# Altium project 3D_Scanner.PrjPcb
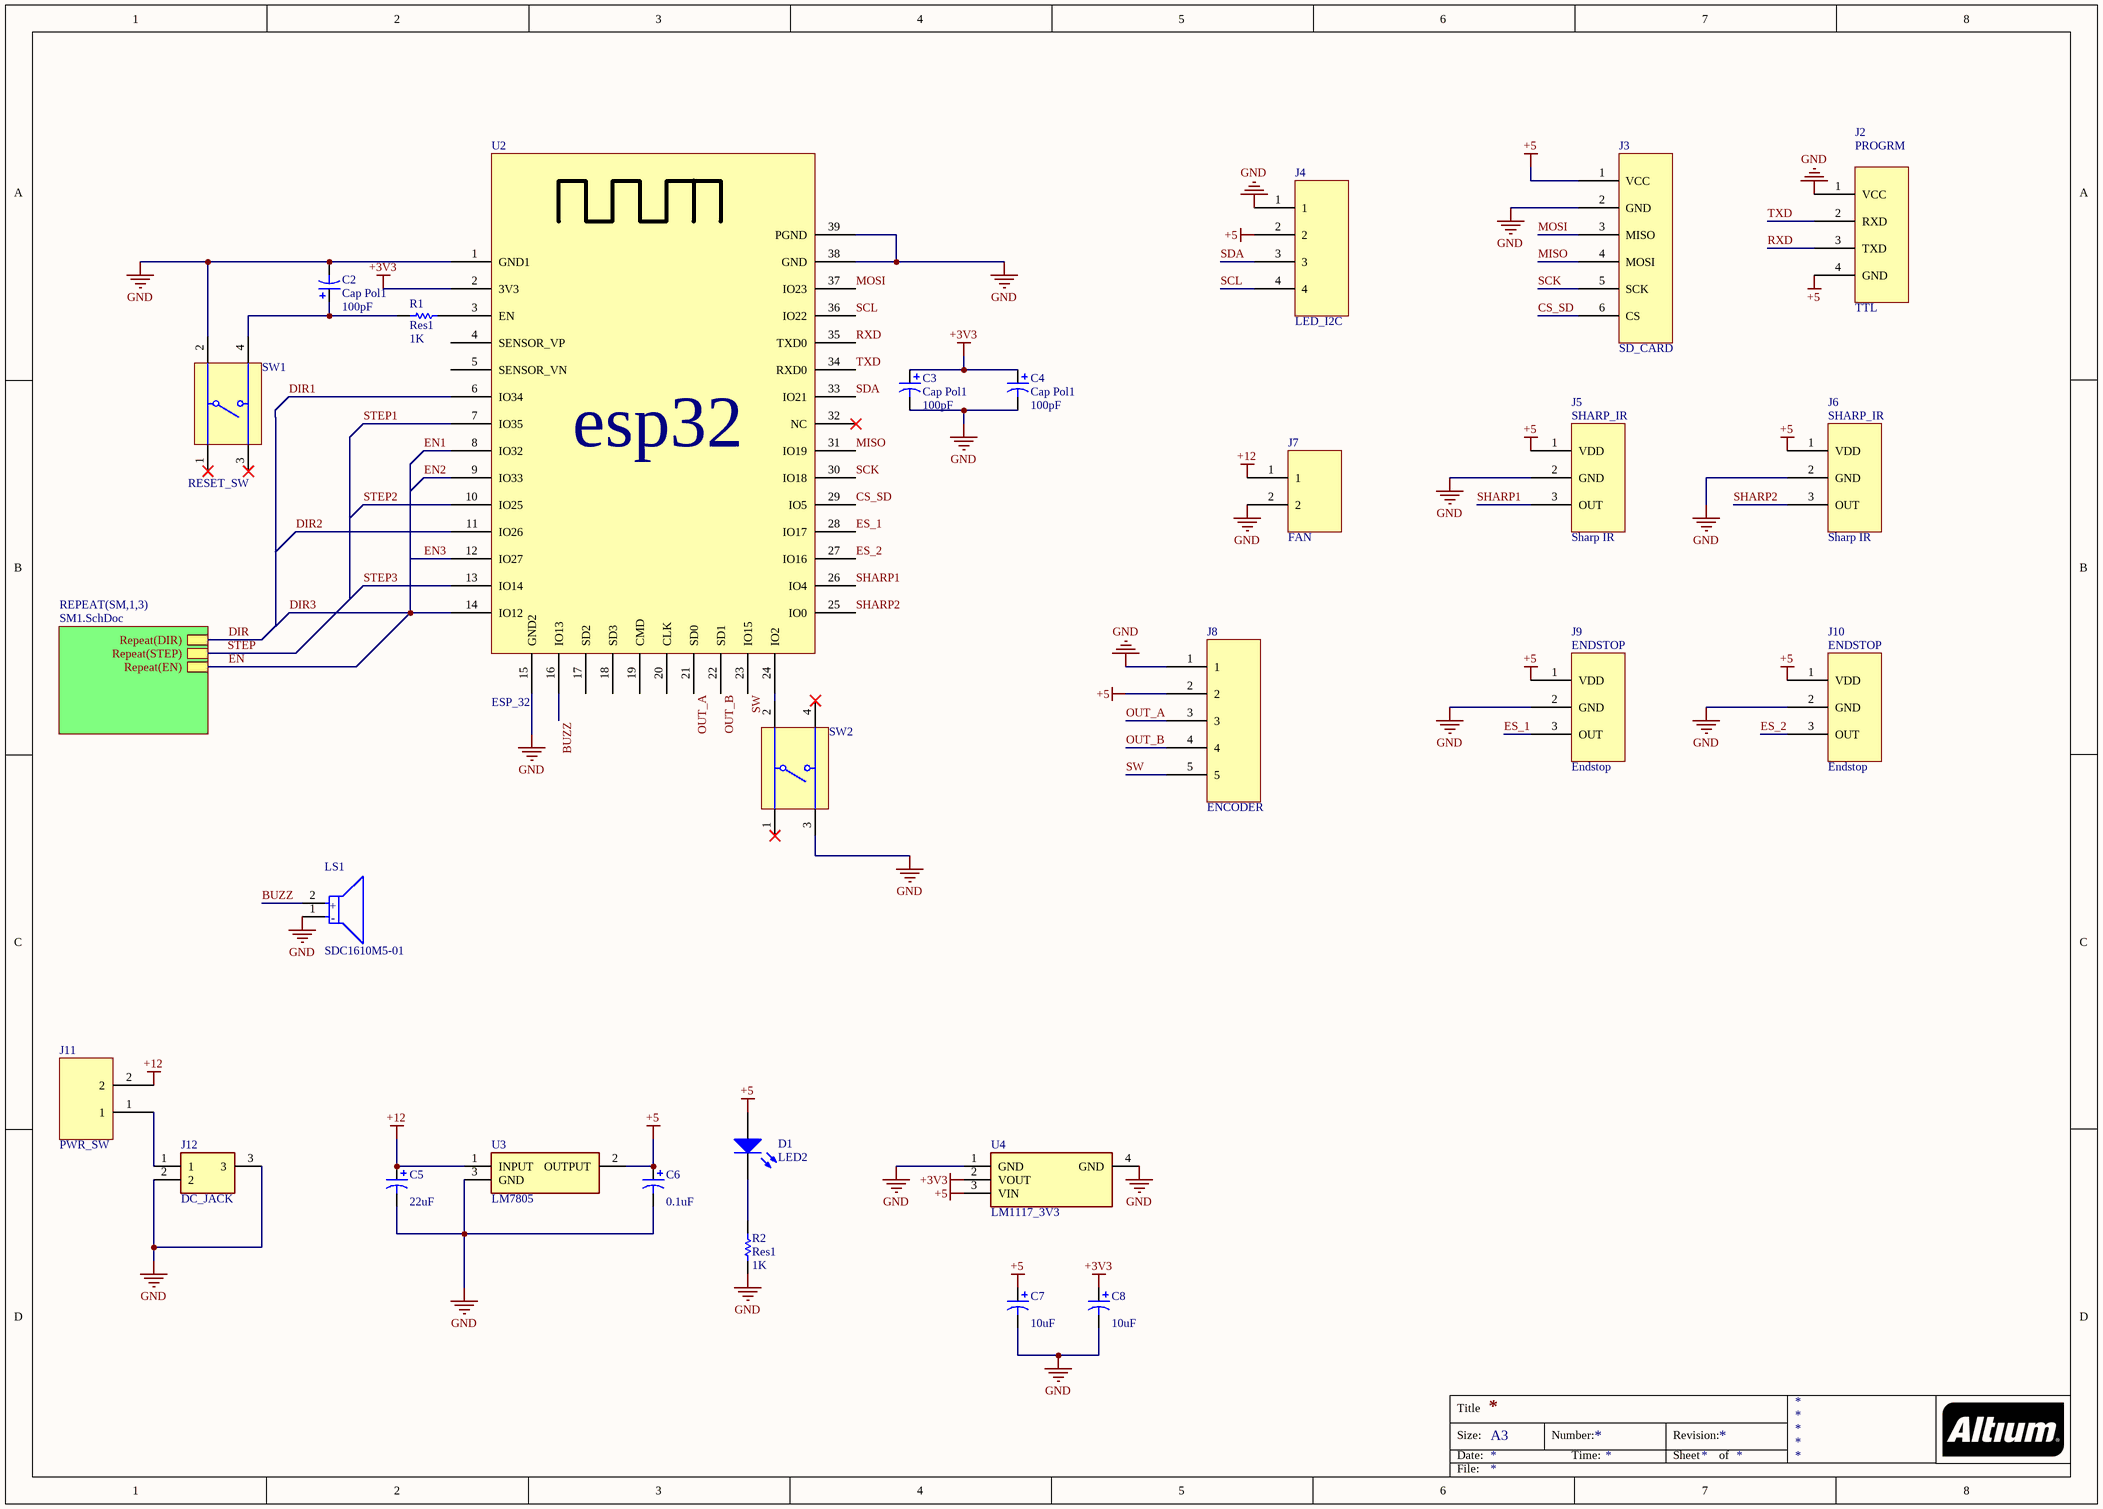
[diagram p0: Sheet.SchDoc]
2 sheets, 36 parts. Net scope: hierarchical (ports join the sheet entries above them; power ports are global).
Board file: PCB1.PcbDoc
Sheets:
  Sheet.SchDoc
    SM1 = SM1.SchDoc
    SM2 = SM1.SchDoc
    SM3 = SM1.SchDoc

## Sheet Sheet.SchDoc
size A3

### Parts
C2  Cap Pol1  value 100pF  [6-0805_N]
C3  Cap Pol1  value 100pF  [6-0805_N]
C4  Cap Pol1  value 100pF  [6-0805_N]
C5  value 22uF  [6-0805_N]  (hidden comment: Cap Pol1)
C6  value 0.1uF  [6-0805_N]  (hidden comment: Cap Pol1)
C7  value 10uF  [6-0805_N]  (hidden comment: Cap Pol1)
C8  value 10uF  [6-0805_N]  (hidden comment: Cap Pol1)
D1  LED2  [3.2X1.6X1.1]
J2  TTL  [TTL]
J3  SD_CARD  [SD_CARD]
J4  LED_I2C  [JST_4P]
J5  Sharp IR  [SHARP_IR]
J6  Sharp IR  [SHARP_IR]
J7  FAN  [JST_2P]
J8  ENCODER  [JST_5P]
J9  Endstop  [ENDSTOP]
J10  Endstop  [ENDSTOP]
J11  PWR_SW  [JST_2P]
J12  DC_JACK  [DC_JACK]
LS1  SDC1610M5-01  [FP-SDC1610M5-01-MFG]
R1  Res1  value 1K  [6-0805_N]
R2  Res1  value 1K  [6-0805_N]
SW1  RESET_SW  [TECO-1825910-6_V]
SW2  1825910-6  [TECO-1825910-6_V]  (value not drawn)
U2  ESP_32  [ESP_SoC_Module]
U3  LM7805  [LM7805]
U4  LM1117_3V3  [LM1117_3V3]

### Sub-sheets
REPEAT(SM,1,3) = SM1.SchDoc: Repeat(DIR), Repeat(STEP), Repeat(EN)

### Nets
+3V3: C3.1 C4.1 C8.1 U2.2(3V3) U4.2(VOUT)
+5: C6.1 C7.1 D1.1(A) J2.4(GND) J3.1(VCC) J4.2 J5.1(VDD) J6.1(VDD) J8.2 J9.1(VDD) J10.1(VDD) U3.2(OUTPUT) U4.3(VIN)
+12: C5.1 J7.1 J11.2 U3.1(INPUT)
GND: C2.2 C3.2 C4.2 C5.2 C6.2 C7.2 C8.2 J2.1(VCC) J3.2(GND) J4.1 J5.2(GND) J6.2(GND) J7.2 J8.1 J9.2(GND) J10.2(GND) J12.2 J12.3 LS1.1(C) R2.1 SW1.2 SW2.3 U2.1(GND1) U2.15(GND2) U2.38(GND) U2.39(PGND) U3.3(GND) U4.1(GND) U4.4(GND)
BUZZ: LS1.2(A) U2.16(IO13)
CS_SD: J3.6(CS) U2.29(IO5)
DIR: sheet REPEAT(SM,1,3)/Repeat(DIR)
DIR1: U2.6(IO34)
DIR2: U2.11(IO26)
DIR3: U2.14(IO12)
EN: sheet REPEAT(SM,1,3)/Repeat(EN)
EN1: U2.8(IO32)
EN2: U2.9(IO33)
EN3: U2.12(IO27)
ES_1: J9.3(OUT) U2.28(IO17)
ES_2: J10.3(OUT) U2.27(IO16)
MISO: J3.4(MOSI) U2.31(IO19)
MOSI: J3.3(MISO) U2.37(IO23)
OUT_A: J8.3 U2.21(SD0)
OUT_B: J8.4 U2.22(SD1)
RXD: J2.3(TXD) U2.35(TXD0)
SCK: J3.5(SCK) U2.30(IO18)
SCL: J4.4 U2.36(IO22)
SDA: J4.3 U2.33(IO21)
SHARP1: J5.3(OUT) U2.26(IO4)
SHARP2: J6.3(OUT) U2.25(IO0)
STEP: sheet REPEAT(SM,1,3)/Repeat(STEP)
STEP1: U2.7(IO35)
STEP2: U2.10(IO25)
STEP3: U2.13(IO14)
SW: J8.5 U2.23(IO15)
TXD: J2.2(RXD) U2.34(RXD0)
NetC2_1: C2.1 R1.1 SW1.4
NetD1_2: D1.2(K) R2.2
NetJ11_1: J11.1 J12.1
NetR1_2: R1.2 U2.3(EN)
NetSW2_2: SW2.2 U2.24(IO2)

Not connected (* = marked no-connect by the designer): SW1 1* 3*; SW2 1* 4*; U2 4(SENSOR_VP) 5(SENSOR_VN) 17(SD2) 18(SD3) 19(CMD) 20(CLK) 32(NC)*

### Notes on the sheet
- Title
- Size:
- Date:
- A3
- Number:
- Time:
- Revision:
- Sheet
- of
- File:
- (in symbol CMP-08413-000008-1) +; -
- (in symbol ESP_SoC_Module) esp32
- (in symbol TTL) PROGRM

### Library data of the parts
C2-C8 = Cap Pol1: Polarized Capacitor (Radial); Published: 8-Jun-2000; LatestRevisionDate: 17-Jul-2002; LatestRevisionNote: Re-released for DXP Platform.; PackageReference: RB7.6-15; Publisher: Altium Limited; PackageDescription: Polarized Capacitor (Radial); 2 Leads
D1 = LED2: Typical RED, GREEN, YELLOW, AMBER GaAs LED; Published: 8-Jun-2000; LatestRevisionDate: 17-Jul-2002; LatestRevisionNote: Re-released for DXP Platform.; PackageVersion: Feb-2002; PackageReference: 3.2X1.6X1.1; Publisher: Altium Limited; PackageDescription: SM LED; 2 Flat Leads
J4 = JST_4P
J5 J6 = SHARP_IR
J7 J11 = JST_2P
J8 = JST_5P
LS1 = CMP-08413-000008-1: AUDIO MAGNETIC INDICATOR 4-8V TH; Nominal Supply Voltage (DC): 5V; Input Type: DC; Max Supply Current: 30mA; Number of Terminals/Pins: 2; Frequency: 2.4kHz; Lead Free: Lead Free; Operating Supply Current: 30mA; Sensing Method: Magnetic; Termination: PC Pins; Number of Pins: 2; Mount: Through Hole; Min Operating Temperature: -10°C; Diameter: 16mm; Series: SDC; Max Operating Temperature: 70°C; Packaging: Tray; Voltage Rating: 5V; Height: 10mm
R1 R2 = Res1: Resistor; Published: 8-Jun-2000; LatestRevisionDate: 17-Jul-2002; LatestRevisionNote: Re-released for DXP Platform.; PackageReference: AXIAL-0.3; Publisher: Altium Limited; PackageDescription: Axial Device, Thru-Hole; 2 Leads; 0.3 in Pin Spacing
SW1 = CMP-1684-00021-1: Tact Switch, SPST-NO, 0.05 A, -35 to 85 degC, 4-Pin THD, RoHS, Bulk; Part No: 1825910-6; Manufacturer: TE Connectivity; Maximum Contact Resistance: 100mOhm; Mechanical Life: 100000Cycles; Bushing Type: Unthreaded; Switch Configuration: OFF(ON); Maximum DC Voltage Rating: 24V; Contact Rating @ Voltage: 0.05A@24VDC; Actuator Color: Black; Body Orientation: Straight; Function: MomentaryContact; Illumination: N/R; Actuator Style: RoundButton; Actuator Material: PolybutyleneTerephthalate; Dielectric Strength: 500VAC; Pole Throw Configuration: SPST; Actuator Length: 1.4mm; Product Weight: N/A; Contact Material: CopperAlloy; Housing Material: N/A; Terminal Type: PCPins; Minimum Insulation Resistance: 100MOhm; Package Description: 4-Pin Through Hole Device, Body 5.99 x 5.99 mm, Pitch 6.5 mm; Package Reference: THD; Base Material: N/A; Manufacturer URL: http://www.te.com; Contact Plating: Silver; RoHS: Yes; Datasheet Version: Rev. C9; Electrical Life: 100000Cycles; Maximum AC Voltage Rating: N/A; Thread Size: N/R; Operating Temperature: -35to85C; Mounting: ThroughHole; Dimension: 5.99x5mm; Datasheet URL: http://www.te.com/commerce/DocumentDelivery/DDEController?Action=showdoc&DocId=Customer+Drawing%7F1825910%7FC9%7Fpdf%7FEnglish%7FENG_CD_1825910_C9.pdf%7F1825910-6; Family: 1825910; Seal Location: N/A; Seal Description: N/A; Packaging: N/A
SW2 = CMP-1684-00021-1: Tact Switch, SPST-NO, 0.05 A, -35 to 85 degC, 4-Pin THD, RoHS, Bulk; Manufacturer: TE Connectivity; Maximum Contact Resistance: 100mOhm; Mechanical Life: 100000Cycles; Bushing Type: Unthreaded; Switch Configuration: OFF(ON); Maximum DC Voltage Rating: 24V; Contact Rating @ Voltage: 0.05A@24VDC; Actuator Color: Black; Body Orientation: Straight; Function: MomentaryContact; Illumination: N/R; Actuator Style: RoundButton; Actuator Material: PolybutyleneTerephthalate; Dielectric Strength: 500VAC; Pole Throw Configuration: SPST; Actuator Length: 1.4mm; Product Weight: N/A; Contact Material: CopperAlloy; Housing Material: N/A; Terminal Type: PCPins; Minimum Insulation Resistance: 100MOhm; Package Description: 4-Pin Through Hole Device, Body 5.99 x 5.99 mm, Pitch 6.5 mm; Part No: 1825910-6; Package Reference: THD; Base Material: N/A; Manufacturer URL: http://www.te.com; Contact Plating: Silver; RoHS: Yes; Datasheet Version: Rev. C9; Electrical Life: 100000Cycles; Maximum AC Voltage Rating: N/A; Thread Size: N/R; Operating Temperature: -35to85C; Mounting: ThroughHole; Dimension: 5.99x5mm; Datasheet URL: http://www.te.com/commerce/DocumentDelivery/DDEController?Action=showdoc&DocId=Customer+Drawing%7F1825910%7FC9%7Fpdf%7FEnglish%7FENG_CD_1825910_C9.pdf%7F1825910-6; Family: 1825910; Seal Location: N/A; Seal Description: N/A; Packaging: N/A
U2 = ESP_SoC_Module

## Sheet SM1.SchDoc
size A
Used 3 times, as channels SM1, SM2, SM3. Parts and nets are listed once, with the designators drawn on the sheet.
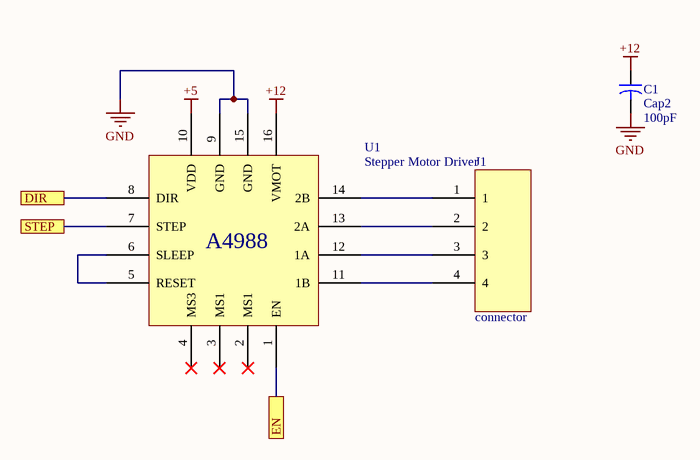
[diagram p1: SM1.SchDoc]

### Parts
C1  Cap2  value 100pF  [CAPR5-4X5]
J1  connector  [JST_4P]
U1  Stepper Motor Driver  [A4988]

### Ports
DIR, EN, STEP

### Nets
+5: U1.10(VDD)
+12: C1.1 U1.16(VMOT)
GND: C1.2 U1.9(GND) U1.15(GND)
DIR: U1.8(DIR) ; port DIR
EN: U1.1(EN) ; port EN
STEP: U1.7(STEP) ; port STEP
NetJ1_1: J1.1 U1.14(2B)
NetJ1_2: J1.2 U1.13(2A)
NetJ1_3: J1.3 U1.12(1A)
NetJ1_4: J1.4 U1.11(1B)
NetU1_5: U1.5(RESET) U1.6(SLEEP)

Not connected (* = marked no-connect by the designer): U1 2(MS1)* 3(MS1)* 4(MS3)*

### Channels
SM1: designators end in _SM1; ports DIR=DIR1 EN=EN1 STEP=STEP1
SM2: designators end in _SM2; ports DIR=DIR2 EN=EN2 STEP=STEP2
SM3: designators end in _SM3; ports DIR=DIR3 EN=EN3 STEP=STEP3

### Library data of the parts
C1 = Cap2: Capacitor; Published: 23-Sep-2002; PackageReference: CAPR5-4X5; Publisher: Altium Limited; PackageDescription: Capacitor; 2 Leads
J1 = JST_4P
U1 = A4988

## Nets that join several sheets
+5: Sheet (13 pins), SM1 (U1_SM1.10), SM2 (U1_SM2.10), SM3 (U1_SM3.10)
+12: Sheet (C5.1 J7.1 J11.2 U3.1), SM1 (C1_SM1.1 U1_SM1.16), SM2 (C1_SM2.1 U1_SM2.16), SM3 (C1_SM3.1 U1_SM3.16)
GND: Sheet (29 pins), SM1 (C1_SM1.2 U1_SM1.9 U1_SM1.15), SM2 (C1_SM2.2 U1_SM2.9 U1_SM2.15), SM3 (C1_SM3.2 U1_SM3.9 U1_SM3.15)
DIR1: Sheet (U2.6), SM1 (U1_SM1.8)
DIR2: Sheet (U2.11), SM2 (U1_SM2.8)
DIR3: Sheet (U2.14), SM3 (U1_SM3.8)
EN1: Sheet (U2.8), SM1 (U1_SM1.1)
EN2: Sheet (U2.9), SM2 (U1_SM2.1)
EN3: Sheet (U2.12), SM3 (U1_SM3.1)
STEP1: Sheet (U2.7), SM1 (U1_SM1.7)
STEP2: Sheet (U2.10), SM2 (U1_SM2.7)
STEP3: Sheet (U2.13), SM3 (U1_SM3.7)